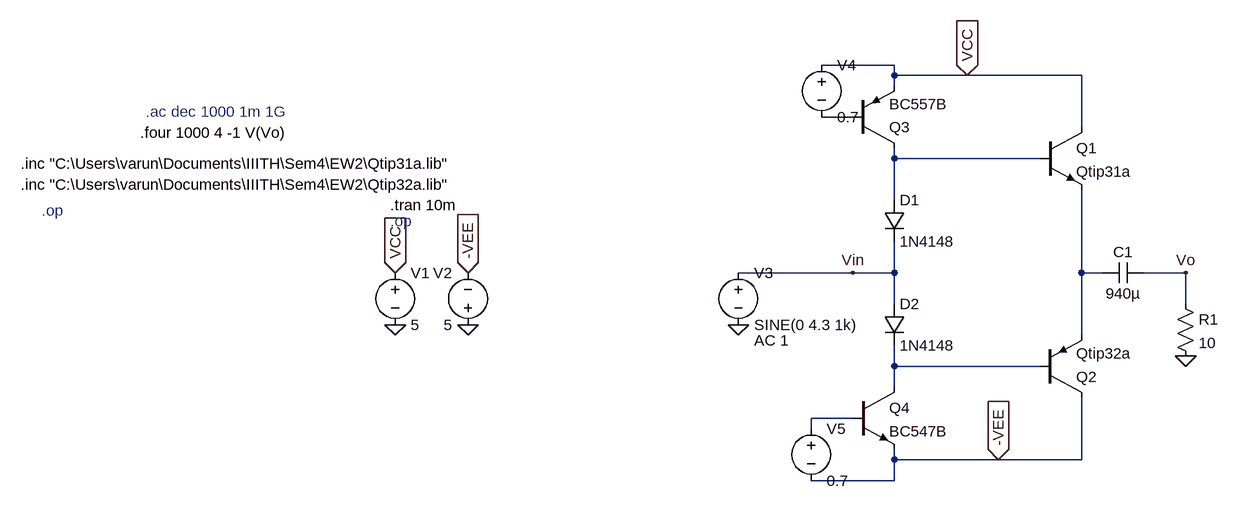
[diagram p0: schematic PowerAmp_5.asc]
PowerAmp_5.asc, the LTspice schematic file:
Version 4
SHEET 1 1236 680
WIRE 736 -144 624 -144
WIRE 736 -128 736 -144
WIRE 848 -128 736 -128
WIRE 1024 -128 848 -128
WIRE 736 -112 736 -128
WIRE 672 -64 624 -64
WIRE 1024 -48 1024 -128
WIRE 736 0 736 -16
WIRE 960 0 736 0
WIRE 736 64 736 0
WIRE 672 176 496 176
WIRE 736 176 736 128
WIRE 736 176 672 176
WIRE 1024 176 1024 48
WIRE 1056 176 1024 176
WIRE 1184 176 1120 176
WIRE 736 224 736 176
WIRE 1184 224 1184 176
WIRE 1024 272 1024 176
WIRE 736 320 736 288
WIRE 960 320 736 320
WIRE 736 352 736 320
WIRE 672 400 608 400
WIRE 608 416 608 400
WIRE 736 464 736 448
WIRE 896 464 736 464
WIRE 1024 464 1024 368
WIRE 1024 464 896 464
WIRE 736 496 736 464
WIRE 736 496 608 496
FLAG 1184 304 0
FLAG 1184 176 Vo
FLAG 80 256 0
FLAG -32 256 0
FLAG -32 176 VCC
IOPIN -32 176 In
FLAG 80 176 -VEE
IOPIN 80 176 In
FLAG 848 -128 VCC
IOPIN 848 -128 In
FLAG 896 464 -VEE
IOPIN 896 464 In
FLAG 496 256 0
FLAG 672 176 Vin
SYMBOL diode 720 64 R0
SYMATTR InstName D1
SYMATTR Value 1N4148
SYMBOL diode 720 224 R0
SYMATTR InstName D2
SYMATTR Value 1N4148
SYMBOL npn 960 -48 R0
SYMATTR InstName Q1
SYMATTR Value Qtip31a
SYMBOL pnp 960 368 M180
SYMATTR InstName Q2
SYMATTR Value Qtip32a
SYMBOL res 1168 208 R0
SYMATTR InstName R1
SYMATTR Value 10
SYMBOL voltage -32 160 R0
SYMATTR InstName V1
SYMATTR Value 5
SYMBOL voltage 80 272 R180
WINDOW 0 24 96 Left 2
WINDOW 3 24 16 Left 2
SYMATTR InstName V2
SYMATTR Value 5
SYMBOL cap 1120 160 R90
WINDOW 0 0 32 VBottom 2
WINDOW 3 32 32 VTop 2
SYMATTR InstName C1
SYMATTR Value 940µ
SYMBOL voltage 496 160 R0
WINDOW 123 24 120 Left 2
WINDOW 39 0 0 Left 0
SYMATTR Value2 AC 1
SYMATTR InstName V3
SYMATTR Value SINE(0 4.3 1k)
SYMBOL pnp 672 -16 M180
SYMATTR InstName Q3
SYMATTR Value BC557B
SYMBOL voltage 624 -160 R0
SYMATTR InstName V4
SYMATTR Value 0.7
SYMBOL npn 672 352 R0
SYMATTR InstName Q4
SYMATTR Value BC547B
SYMBOL voltage 608 400 R0
SYMATTR InstName V5
SYMATTR Value 0.7
TEXT -40 72 Left 2 !.tran 10m
TEXT -608 40 Left 2 !.inc "C:\\Users\\varun\\Documents\\IIITH\\Sem4\\EW2\\Qtip32a.lib"
TEXT -608 8 Left 2 !.inc "C:\\Users\\varun\\Documents\\IIITH\\Sem4\\EW2\\Qtip31a.lib"
TEXT -416 -72 Left 2 ;.ac dec 1000 1m 1G
TEXT -40 96 Left 2 ;.op
TEXT -424 -40 Left 2 !.four 1000 4 -1 V(Vo)
TEXT -576 80 Left 2 ;.op

The netlist it stands for:
* PowerAmp_5.asc
D1 N002 Vin 1N4148
D2 Vin N004 1N4148
Q1 VCC N002 N003 0 Qtip31a
Q2 -VEE N004 N003 0 Qtip32a
R1 Vo 0 10
V1 VCC 0 5
V2 0 -VEE 5
C1 Vo N003 940µ
V3 Vin 0 SINE(0 4.3 1k) AC 1
Q3 N002 N001 VCC 0 BC557B
V4 VCC N001 0.7
Q4 N004 N005 -VEE 0 BC547B
V5 N005 -VEE 0.7
.model D D
.lib standard.dio
.model NPN NPN
.model PNP PNP
.lib standard.bjt
.tran 10m
.inc "C:\Users\varun\Documents\IIITH\Sem4\EW2\Qtip32a.lib"
.inc "C:\Users\varun\Documents\IIITH\Sem4\EW2\Qtip31a.lib"
* .ac dec 1000 1m 1G
* .op
.four 1000 4 -1 V(Vo)
* .op
.backanno
.end